# Altium project DIMM Module Tester CS.PrjPcb
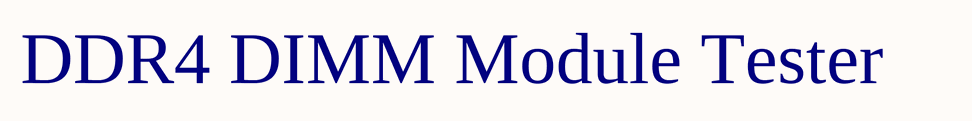
[diagram p0: DIMM Module Tester.SchDoc]
3 sheets, 287 parts. Net scope: global (net labels, ports and power ports of the same name join across sheets).
Sheets:
  DIMM Module Tester.SchDoc
  SPD.SchDoc
  Testpoints.SchDoc

## Sheet DIMM Module Tester.SchDoc
size A3

### Notes on the sheet
- DDR4 DIMM Module Tester

## Sheet SPD.SchDoc
size A3
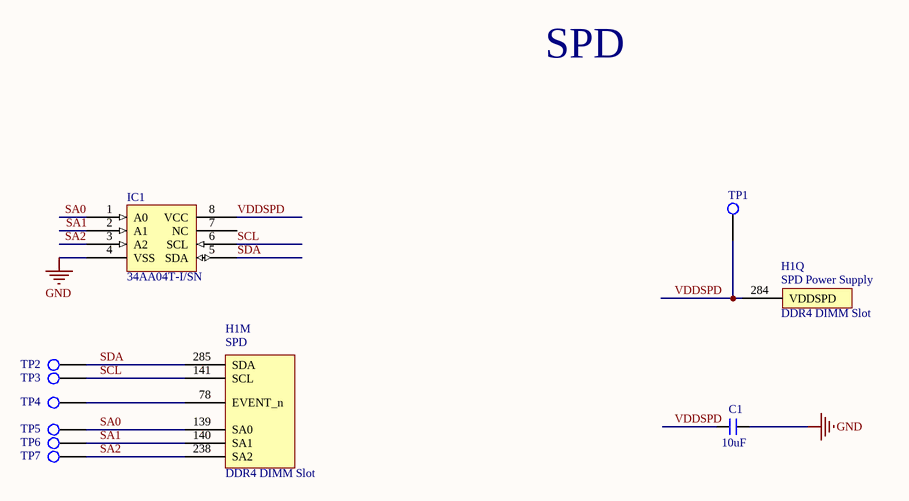
[diagram p1: SPD.SchDoc]

### Parts
C1  Capacitance: 10uF  [Capacitor 0603]  (hidden comment: Capacitor 0603)
H1  DDR4 DIMM Slot  [DDR4 DIMM]  (parts M,Q of 21)
IC1  34AA04T-I/SN  [34AA04T-I/SN]
TP1  Test Point  [Test Point]  (value not drawn)
TP2  Test Point  [Test Point]  (value not drawn)
TP3  Test Point  [Test Point]  (value not drawn)
TP4  Test Point  [Test Point]  (value not drawn)
TP5  Test Point  [Test Point]  (value not drawn)
TP6  Test Point  [Test Point]  (value not drawn)
TP7  Test Point  [Test Point]  (value not drawn)

### Nets
GND: C1.2 IC1.4(VSS)
SA0: H1.139(SA0) IC1.1(A0) TP5.1
SA1: H1.140(SA1) IC1.2(A1) TP6.1
SA2: H1.238(SA2) IC1.3(A2) TP7.1
SCL: H1.141(SCL) IC1.6(SCL) TP3.1
SDA: H1.285(SDA) IC1.5(SDA) TP2.1
VDDSPD: C1.1 H1.284(VDDSPD) IC1.8(VCC) TP1.1
NetH1_78: H1.78(EVENT_n) TP4.1

Not connected (* = marked no-connect by the designer): IC1 7(NC)

### Notes on the sheet
- SPD
- (in symbol DDR4 DIMM Slot, part M) SPD
- (in symbol DDR4 DIMM Slot, part Q) SPD Power Supply

### Library data of the parts
C1 = Capacitor 0603: Manufacturer: Vishay; Manufacturer Part Number: CRCW060310K0FKEA; Max Power Dissipation: 100mW; Tolerance: 1%; Voltage Rating: 75V; Temperature Coefficient: 100ppm/°C; Supplier 1: Avnet Europe; Stock 1: 305000; Pricing 1: 5000=0.00444, 10000=0.00432, 20000=0.00421, 30000=0.0041, 40000=0.004 (EUR); Case/Package: 0603; Number of Pins: 2; Weight: 7.1E-05oz; Contact Plating: Tin,Lead; Case Code (Metric): 1608; Case Code (Imperial): 0603; Min Operating Temperature: -55°C; Max Operating Temperature: 155°C; Packaging: Tape and Reel; Package Quantity: 10; Termination: SMD/SMT; Power Rating: 100mW; Composition: Thick Film; Number of Terminations: 2; Military Standard: Not; Voltage Rating (DC): 75V; Features: Automotive AEC-Q200; Length: 1.55mm; Height: 0.45mm; Width: 0.033inch; Depth: 0.85mm; Radiation Hardening: No; REACH SVHC: Unknown; Lead Free: Lead Free

## Sheet Testpoints.SchDoc
size A3
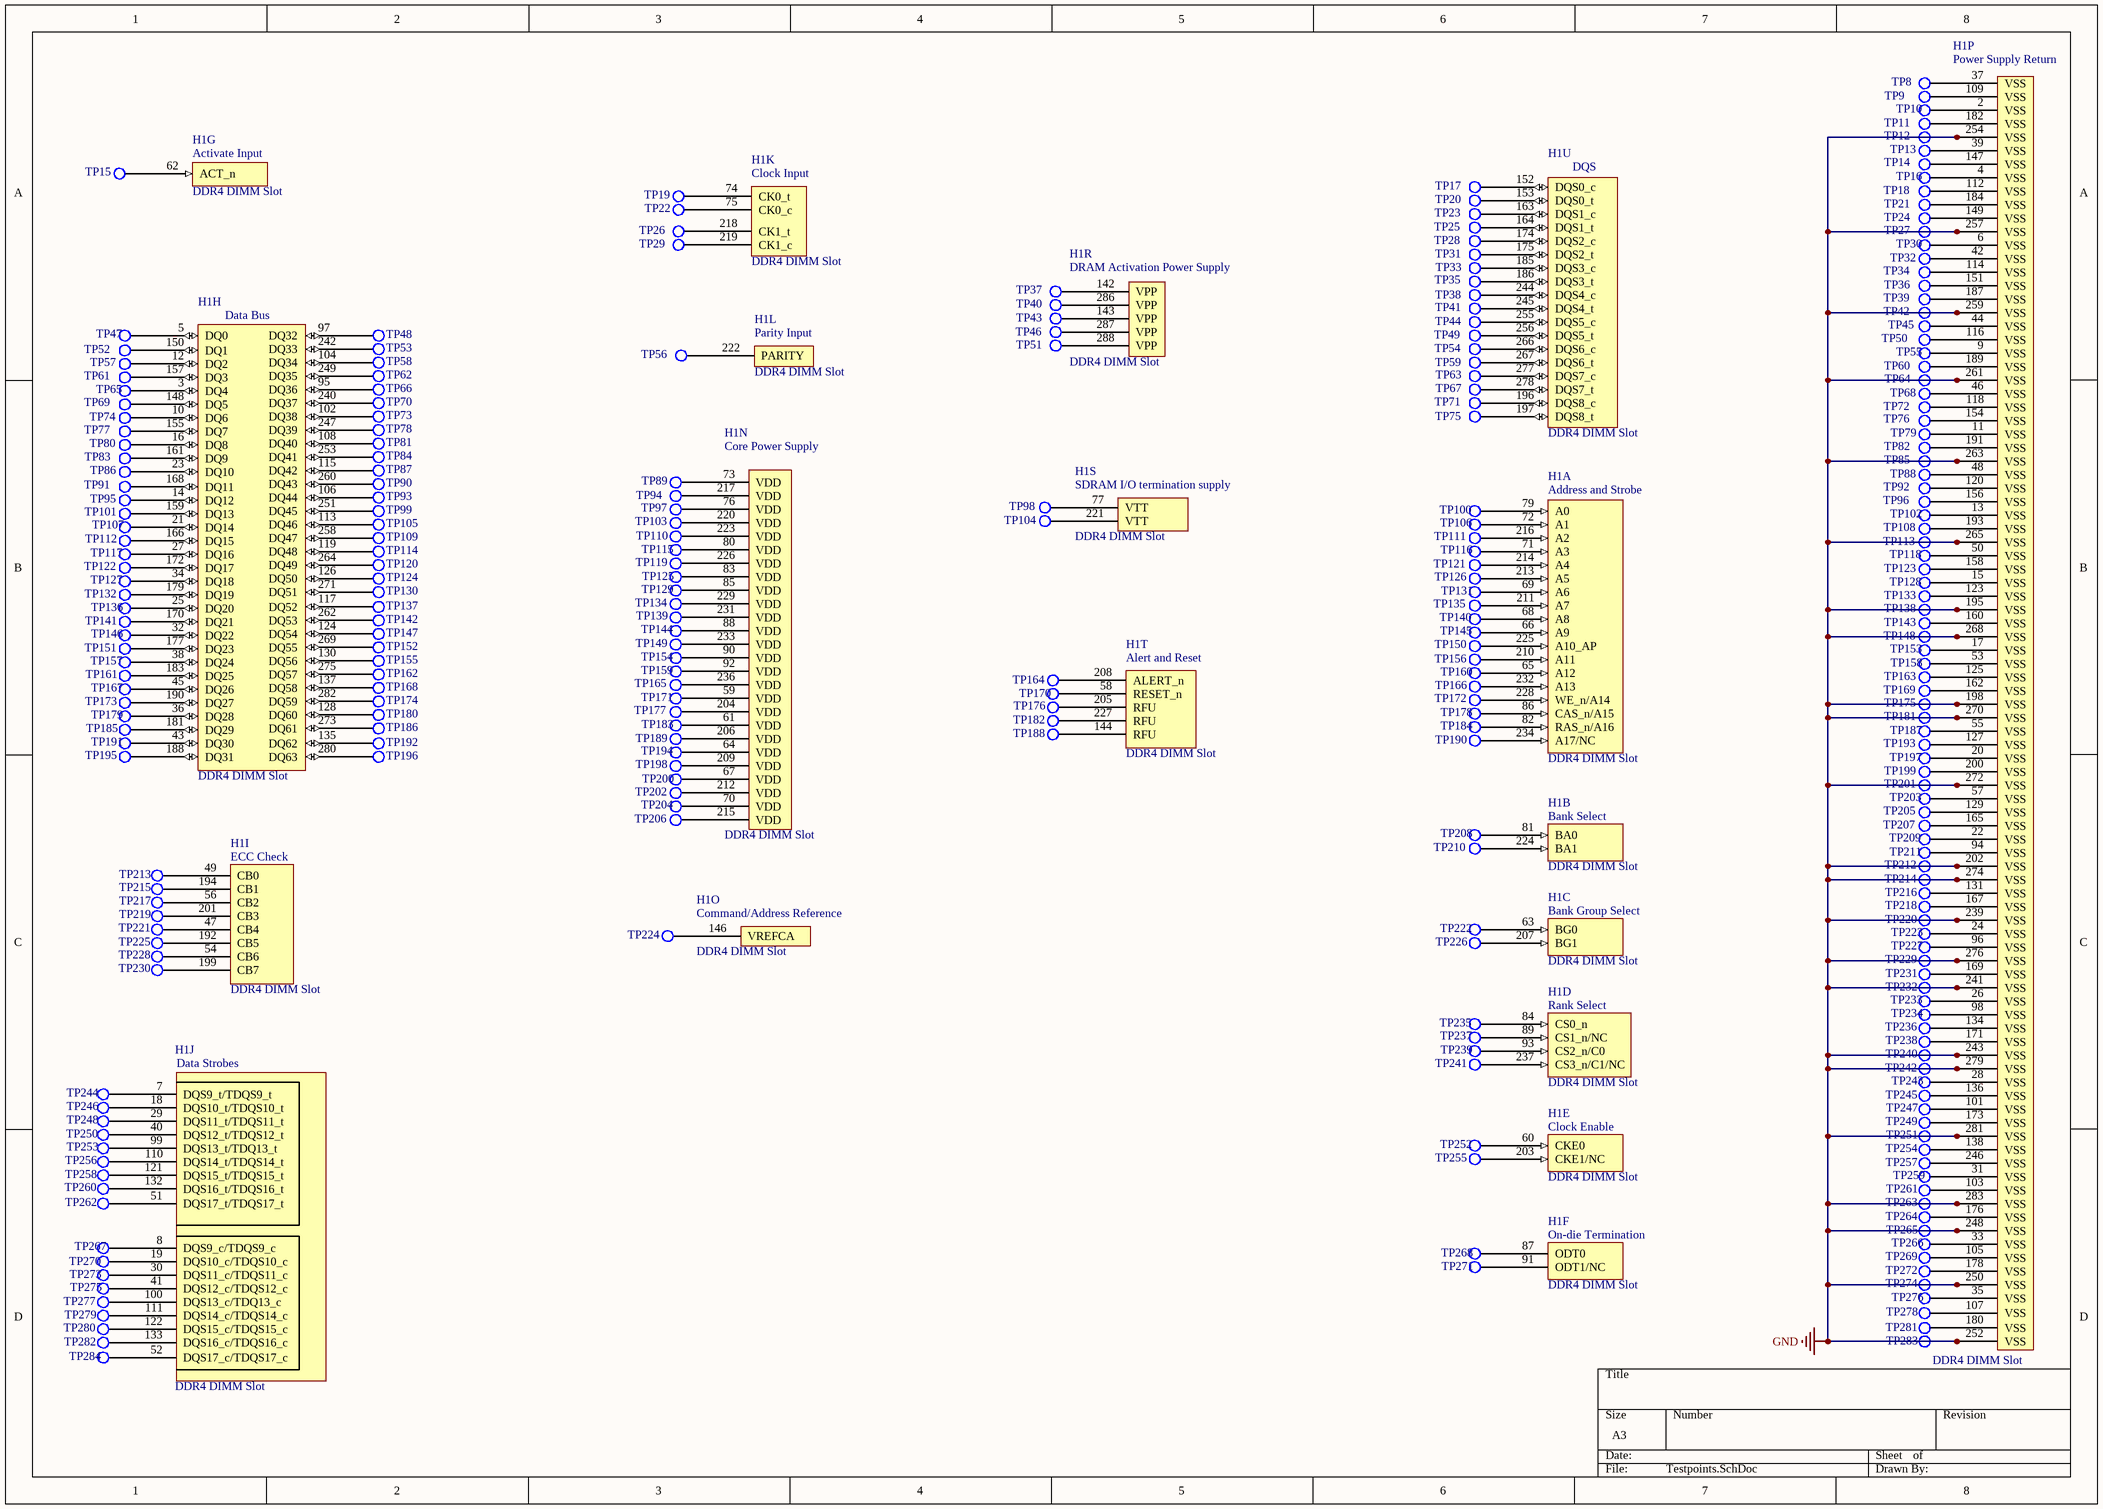
[diagram p2: Testpoints.SchDoc]

### Parts
H1  DDR4 DIMM Slot  [DDR4 DIMM]  (parts A,B,C,D,E,F,G,H,I,J,K,L,N,O,P,R,S,T,U of 21)
TP8  Test Point  [Test Point]  (value not drawn)
TP9  Test Point  [Test Point]  (value not drawn)
TP10  Test Point  [Test Point]  (value not drawn)
TP11  Test Point  [Test Point]  (value not drawn)
TP12  Test Point  [Test Point]  (value not drawn)
TP13  Test Point  [Test Point]  (value not drawn)
TP14  Test Point  [Test Point]  (value not drawn)
TP15  Test Point  [Test Point]  (value not drawn)
TP16  Test Point  [Test Point]  (value not drawn)
TP17  Test Point  [Test Point]  (value not drawn)
TP18  Test Point  [Test Point]  (value not drawn)
TP19  Test Point  [Test Point]  (value not drawn)
TP20  Test Point  [Test Point]  (value not drawn)
TP21  Test Point  [Test Point]  (value not drawn)
TP22  Test Point  [Test Point]  (value not drawn)
TP23  Test Point  [Test Point]  (value not drawn)
TP24  Test Point  [Test Point]  (value not drawn)
TP25  Test Point  [Test Point]  (value not drawn)
TP26  Test Point  [Test Point]  (value not drawn)
TP27  Test Point  [Test Point]  (value not drawn)
TP28  Test Point  [Test Point]  (value not drawn)
TP29  Test Point  [Test Point]  (value not drawn)
TP30  Test Point  [Test Point]  (value not drawn)
TP31  Test Point  [Test Point]  (value not drawn)
TP32  Test Point  [Test Point]  (value not drawn)
TP33  Test Point  [Test Point]  (value not drawn)
TP34  Test Point  [Test Point]  (value not drawn)
TP35  Test Point  [Test Point]  (value not drawn)
TP36  Test Point  [Test Point]  (value not drawn)
TP37  Test Point  [Test Point]  (value not drawn)
TP38  Test Point  [Test Point]  (value not drawn)
TP39  Test Point  [Test Point]  (value not drawn)
TP40  Test Point  [Test Point]  (value not drawn)
TP41  Test Point  [Test Point]  (value not drawn)
TP42  Test Point  [Test Point]  (value not drawn)
TP43  Test Point  [Test Point]  (value not drawn)
TP44  Test Point  [Test Point]  (value not drawn)
TP45  Test Point  [Test Point]  (value not drawn)
TP46  Test Point  [Test Point]  (value not drawn)
TP47  Test Point  [Test Point]  (value not drawn)
TP48  Test Point  [Test Point]  (value not drawn)
TP49  Test Point  [Test Point]  (value not drawn)
TP50  Test Point  [Test Point]  (value not drawn)
TP51  Test Point  [Test Point]  (value not drawn)
TP52  Test Point  [Test Point]  (value not drawn)
TP53  Test Point  [Test Point]  (value not drawn)
TP54  Test Point  [Test Point]  (value not drawn)
TP55  Test Point  [Test Point]  (value not drawn)
TP56  Test Point  [Test Point]  (value not drawn)
TP57  Test Point  [Test Point]  (value not drawn)
TP58  Test Point  [Test Point]  (value not drawn)
TP59  Test Point  [Test Point]  (value not drawn)
TP60  Test Point  [Test Point]  (value not drawn)
TP61  Test Point  [Test Point]  (value not drawn)
TP62  Test Point  [Test Point]  (value not drawn)
TP63  Test Point  [Test Point]  (value not drawn)
TP64  Test Point  [Test Point]  (value not drawn)
TP65  Test Point  [Test Point]  (value not drawn)
TP66  Test Point  [Test Point]  (value not drawn)
TP67  Test Point  [Test Point]  (value not drawn)
TP68  Test Point  [Test Point]  (value not drawn)
TP69  Test Point  [Test Point]  (value not drawn)
TP70  Test Point  [Test Point]  (value not drawn)
TP71  Test Point  [Test Point]  (value not drawn)
TP72  Test Point  [Test Point]  (value not drawn)
TP73  Test Point  [Test Point]  (value not drawn)
TP74  Test Point  [Test Point]  (value not drawn)
TP75  Test Point  [Test Point]  (value not drawn)
TP76  Test Point  [Test Point]  (value not drawn)
TP77  Test Point  [Test Point]  (value not drawn)
TP78  Test Point  [Test Point]  (value not drawn)
TP79  Test Point  [Test Point]  (value not drawn)
TP80  Test Point  [Test Point]  (value not drawn)
TP81  Test Point  [Test Point]  (value not drawn)
TP82  Test Point  [Test Point]  (value not drawn)
TP83  Test Point  [Test Point]  (value not drawn)
TP84  Test Point  [Test Point]  (value not drawn)
TP85  Test Point  [Test Point]  (value not drawn)
TP86  Test Point  [Test Point]  (value not drawn)
TP87  Test Point  [Test Point]  (value not drawn)
TP88  Test Point  [Test Point]  (value not drawn)
TP89  Test Point  [Test Point]  (value not drawn)
TP90  Test Point  [Test Point]  (value not drawn)
TP91  Test Point  [Test Point]  (value not drawn)
TP92  Test Point  [Test Point]  (value not drawn)
TP93  Test Point  [Test Point]  (value not drawn)
TP94  Test Point  [Test Point]  (value not drawn)
TP95  Test Point  [Test Point]  (value not drawn)
TP96  Test Point  [Test Point]  (value not drawn)
TP97  Test Point  [Test Point]  (value not drawn)
TP98  Test Point  [Test Point]  (value not drawn)
TP99  Test Point  [Test Point]  (value not drawn)
TP100  Test Point  [Test Point]  (value not drawn)
TP101  Test Point  [Test Point]  (value not drawn)
TP102  Test Point  [Test Point]  (value not drawn)
TP103  Test Point  [Test Point]  (value not drawn)
TP104  Test Point  [Test Point]  (value not drawn)
TP105  Test Point  [Test Point]  (value not drawn)
TP106  Test Point  [Test Point]  (value not drawn)
TP107  Test Point  [Test Point]  (value not drawn)
TP108  Test Point  [Test Point]  (value not drawn)
TP109  Test Point  [Test Point]  (value not drawn)
TP110  Test Point  [Test Point]  (value not drawn)
TP111  Test Point  [Test Point]  (value not drawn)
TP112  Test Point  [Test Point]  (value not drawn)
TP113  Test Point  [Test Point]  (value not drawn)
TP114  Test Point  [Test Point]  (value not drawn)
TP115  Test Point  [Test Point]  (value not drawn)
TP116  Test Point  [Test Point]  (value not drawn)
TP117  Test Point  [Test Point]  (value not drawn)
TP118  Test Point  [Test Point]  (value not drawn)
TP119  Test Point  [Test Point]  (value not drawn)
TP120  Test Point  [Test Point]  (value not drawn)
TP121  Test Point  [Test Point]  (value not drawn)
TP122  Test Point  [Test Point]  (value not drawn)
TP123  Test Point  [Test Point]  (value not drawn)
TP124  Test Point  [Test Point]  (value not drawn)
TP125  Test Point  [Test Point]  (value not drawn)
TP126  Test Point  [Test Point]  (value not drawn)
TP127  Test Point  [Test Point]  (value not drawn)
TP128  Test Point  [Test Point]  (value not drawn)
TP129  Test Point  [Test Point]  (value not drawn)
TP130  Test Point  [Test Point]  (value not drawn)
TP131  Test Point  [Test Point]  (value not drawn)
TP132  Test Point  [Test Point]  (value not drawn)
TP133  Test Point  [Test Point]  (value not drawn)
TP134  Test Point  [Test Point]  (value not drawn)
TP135  Test Point  [Test Point]  (value not drawn)
TP136  Test Point  [Test Point]  (value not drawn)
TP137  Test Point  [Test Point]  (value not drawn)
TP138  Test Point  [Test Point]  (value not drawn)
TP139  Test Point  [Test Point]  (value not drawn)
TP140  Test Point  [Test Point]  (value not drawn)
TP141  Test Point  [Test Point]  (value not drawn)
TP142  Test Point  [Test Point]  (value not drawn)
TP143  Test Point  [Test Point]  (value not drawn)
TP144  Test Point  [Test Point]  (value not drawn)
TP145  Test Point  [Test Point]  (value not drawn)
TP146  Test Point  [Test Point]  (value not drawn)
TP147  Test Point  [Test Point]  (value not drawn)
TP148  Test Point  [Test Point]  (value not drawn)
TP149  Test Point  [Test Point]  (value not drawn)
TP150  Test Point  [Test Point]  (value not drawn)
TP151  Test Point  [Test Point]  (value not drawn)
TP152  Test Point  [Test Point]  (value not drawn)
TP153  Test Point  [Test Point]  (value not drawn)
TP154  Test Point  [Test Point]  (value not drawn)
TP155  Test Point  [Test Point]  (value not drawn)
TP156  Test Point  [Test Point]  (value not drawn)
TP157  Test Point  [Test Point]  (value not drawn)
TP158  Test Point  [Test Point]  (value not drawn)
TP159  Test Point  [Test Point]  (value not drawn)
TP160  Test Point  [Test Point]  (value not drawn)
TP161  Test Point  [Test Point]  (value not drawn)
TP162  Test Point  [Test Point]  (value not drawn)
TP163  Test Point  [Test Point]  (value not drawn)
TP164  Test Point  [Test Point]  (value not drawn)
TP165  Test Point  [Test Point]  (value not drawn)
TP166  Test Point  [Test Point]  (value not drawn)
TP167  Test Point  [Test Point]  (value not drawn)
TP168  Test Point  [Test Point]  (value not drawn)
TP169  Test Point  [Test Point]  (value not drawn)
TP170  Test Point  [Test Point]  (value not drawn)
TP171  Test Point  [Test Point]  (value not drawn)
TP172  Test Point  [Test Point]  (value not drawn)
TP173  Test Point  [Test Point]  (value not drawn)
TP174  Test Point  [Test Point]  (value not drawn)
TP175  Test Point  [Test Point]  (value not drawn)
TP176  Test Point  [Test Point]  (value not drawn)
TP177  Test Point  [Test Point]  (value not drawn)
TP178  Test Point  [Test Point]  (value not drawn)
TP179  Test Point  [Test Point]  (value not drawn)
TP180  Test Point  [Test Point]  (value not drawn)
TP181  Test Point  [Test Point]  (value not drawn)
TP182  Test Point  [Test Point]  (value not drawn)
TP183  Test Point  [Test Point]  (value not drawn)
TP184  Test Point  [Test Point]  (value not drawn)
TP185  Test Point  [Test Point]  (value not drawn)
TP186  Test Point  [Test Point]  (value not drawn)
TP187  Test Point  [Test Point]  (value not drawn)
TP188  Test Point  [Test Point]  (value not drawn)
TP189  Test Point  [Test Point]  (value not drawn)
TP190  Test Point  [Test Point]  (value not drawn)
TP191  Test Point  [Test Point]  (value not drawn)
TP192  Test Point  [Test Point]  (value not drawn)
TP193  Test Point  [Test Point]  (value not drawn)
TP194  Test Point  [Test Point]  (value not drawn)
TP195  Test Point  [Test Point]  (value not drawn)
TP196  Test Point  [Test Point]  (value not drawn)
TP197  Test Point  [Test Point]  (value not drawn)
TP198  Test Point  [Test Point]  (value not drawn)
TP199  Test Point  [Test Point]  (value not drawn)
TP200  Test Point  [Test Point]  (value not drawn)
TP201  Test Point  [Test Point]  (value not drawn)
TP202  Test Point  [Test Point]  (value not drawn)
TP203  Test Point  [Test Point]  (value not drawn)
TP204  Test Point  [Test Point]  (value not drawn)
TP205  Test Point  [Test Point]  (value not drawn)
TP206  Test Point  [Test Point]  (value not drawn)
TP207  Test Point  [Test Point]  (value not drawn)
TP208  Test Point  [Test Point]  (value not drawn)
TP209  Test Point  [Test Point]  (value not drawn)
TP210  Test Point  [Test Point]  (value not drawn)
TP211  Test Point  [Test Point]  (value not drawn)
TP212  Test Point  [Test Point]  (value not drawn)
TP213  Test Point  [Test Point]  (value not drawn)
TP214  Test Point  [Test Point]  (value not drawn)
TP215  Test Point  [Test Point]  (value not drawn)
TP216  Test Point  [Test Point]  (value not drawn)
TP217  Test Point  [Test Point]  (value not drawn)
TP218  Test Point  [Test Point]  (value not drawn)
TP219  Test Point  [Test Point]  (value not drawn)
TP220  Test Point  [Test Point]  (value not drawn)
TP221  Test Point  [Test Point]  (value not drawn)
TP222  Test Point  [Test Point]  (value not drawn)
TP223  Test Point  [Test Point]  (value not drawn)
TP224  Test Point  [Test Point]  (value not drawn)
TP225  Test Point  [Test Point]  (value not drawn)
TP226  Test Point  [Test Point]  (value not drawn)
TP227  Test Point  [Test Point]  (value not drawn)
TP228  Test Point  [Test Point]  (value not drawn)
TP229  Test Point  [Test Point]  (value not drawn)
TP230  Test Point  [Test Point]  (value not drawn)
TP231  Test Point  [Test Point]  (value not drawn)
TP232  Test Point  [Test Point]  (value not drawn)
TP233  Test Point  [Test Point]  (value not drawn)
TP234  Test Point  [Test Point]  (value not drawn)
TP235  Test Point  [Test Point]  (value not drawn)
TP236  Test Point  [Test Point]  (value not drawn)
TP237  Test Point  [Test Point]  (value not drawn)
TP238  Test Point  [Test Point]  (value not drawn)
TP239  Test Point  [Test Point]  (value not drawn)
TP240  Test Point  [Test Point]  (value not drawn)
TP241  Test Point  [Test Point]  (value not drawn)
TP242  Test Point  [Test Point]  (value not drawn)
TP243  Test Point  [Test Point]  (value not drawn)
TP244  Test Point  [Test Point]  (value not drawn)
TP245  Test Point  [Test Point]  (value not drawn)
TP246  Test Point  [Test Point]  (value not drawn)
TP247  Test Point  [Test Point]  (value not drawn)
TP248  Test Point  [Test Point]  (value not drawn)
TP249  Test Point  [Test Point]  (value not drawn)
TP250  Test Point  [Test Point]  (value not drawn)
TP251  Test Point  [Test Point]  (value not drawn)
TP252  Test Point  [Test Point]  (value not drawn)
TP253  Test Point  [Test Point]  (value not drawn)
TP254  Test Point  [Test Point]  (value not drawn)
TP255  Test Point  [Test Point]  (value not drawn)
TP256  Test Point  [Test Point]  (value not drawn)
TP257  Test Point  [Test Point]  (value not drawn)
TP258  Test Point  [Test Point]  (value not drawn)
TP259  Test Point  [Test Point]  (value not drawn)
TP260  Test Point  [Test Point]  (value not drawn)
TP261  Test Point  [Test Point]  (value not drawn)
TP262  Test Point  [Test Point]  (value not drawn)
TP263  Test Point  [Test Point]  (value not drawn)
TP264  Test Point  [Test Point]  (value not drawn)
TP265  Test Point  [Test Point]  (value not drawn)
TP266  Test Point  [Test Point]  (value not drawn)
TP267  Test Point  [Test Point]  (value not drawn)
TP268  Test Point  [Test Point]  (value not drawn)
TP269  Test Point  [Test Point]  (value not drawn)
TP270  Test Point  [Test Point]  (value not drawn)
TP271  Test Point  [Test Point]  (value not drawn)
TP272  Test Point  [Test Point]  (value not drawn)
TP273  Test Point  [Test Point]  (value not drawn)
TP274  Test Point  [Test Point]  (value not drawn)
TP275  Test Point  [Test Point]  (value not drawn)
TP276  Test Point  [Test Point]  (value not drawn)
TP277  Test Point  [Test Point]  (value not drawn)
TP278  Test Point  [Test Point]  (value not drawn)
TP279  Test Point  [Test Point]  (value not drawn)
TP280  Test Point  [Test Point]  (value not drawn)
TP281  Test Point  [Test Point]  (value not drawn)
TP282  Test Point  [Test Point]  (value not drawn)
TP283  Test Point  [Test Point]  (value not drawn)
TP284  Test Point  [Test Point]  (value not drawn)

### Nets
GND: H1.195(VSS) H1.198(VSS) H1.202(VSS) H1.239(VSS) H1.241(VSS) H1.243(VSS) H1.248(VSS) H1.250(VSS) H1.252(VSS) H1.254(VSS) H1.257(VSS) H1.259(VSS) H1.261(VSS) H1.263(VSS) H1.265(VSS) H1.268(VSS) H1.270(VSS) H1.272(VSS) H1.274(VSS) H1.276(VSS) H1.279(VSS) H1.281(VSS) H1.283(VSS) TP12.1 TP27.1 TP42.1 TP64.1 TP85.1 TP113.1 TP138.1 TP148.1 TP175.1 TP181.1 TP201.1 TP212.1 TP214.1 TP220.1 TP229.1 TP232.1 TP240.1 TP242.1 TP251.1 TP263.1 TP265.1 TP274.1 TP283.1
NetH1_2: H1.2(VSS) TP10.1
NetH1_3: H1.3(DQ4) TP65.1
NetH1_4: H1.4(VSS) TP16.1
NetH1_5: H1.5(DQ0) TP47.1
NetH1_6: H1.6(VSS) TP30.1
NetH1_7: H1.7(DQS9_t/TDQS9_t) TP244.1
NetH1_8: H1.8(DQS9_c/TDQS9_c) TP267.1
NetH1_9: H1.9(VSS) TP55.1
NetH1_10: H1.10(DQ6) TP74.1
NetH1_11: H1.11(VSS) TP79.1
NetH1_12: H1.12(DQ2) TP57.1
NetH1_13: H1.13(VSS) TP102.1
NetH1_14: H1.14(DQ12) TP95.1
NetH1_15: H1.15(VSS) TP128.1
NetH1_16: H1.16(DQ8) TP80.1
NetH1_17: H1.17(VSS) TP153.1
NetH1_18: H1.18(DQS10_t/TDQS10_t) TP246.1
NetH1_19: H1.19(DQS10_c/TDQS10_c) TP270.1
NetH1_20: H1.20(VSS) TP197.1
NetH1_21: H1.21(DQ14) TP107.1
NetH1_22: H1.22(VSS) TP209.1
NetH1_23: H1.23(DQ10) TP86.1
NetH1_24: H1.24(VSS) TP223.1
NetH1_25: H1.25(DQ20) TP136.1
NetH1_26: H1.26(VSS) TP233.1
NetH1_27: H1.27(DQ16) TP117.1
NetH1_28: H1.28(VSS) TP243.1
NetH1_29: H1.29(DQS11_t/TDQS11_t) TP248.1
NetH1_30: H1.30(DQS11_c/TDQS11_c) TP273.1
NetH1_31: H1.31(VSS) TP259.1
NetH1_32: H1.32(DQ22) TP146.1
NetH1_33: H1.33(VSS) TP266.1
NetH1_34: H1.34(DQ18) TP127.1
NetH1_35: H1.35(VSS) TP276.1
NetH1_36: H1.36(DQ28) TP179.1
NetH1_37: H1.37(VSS) TP8.1
NetH1_38: H1.38(DQ24) TP157.1
NetH1_39: H1.39(VSS) TP13.1
NetH1_40: H1.40(DQS12_t/TDQS12_t) TP250.1
NetH1_41: H1.41(DQS12_c/TDQS12_c) TP275.1
NetH1_42: H1.42(VSS) TP32.1
NetH1_43: H1.43(DQ30) TP191.1
NetH1_44: H1.44(VSS) TP45.1
NetH1_45: H1.45(DQ26) TP167.1
NetH1_46: H1.46(VSS) TP68.1
NetH1_47: H1.47(CB4) TP221.1
NetH1_48: H1.48(VSS) TP88.1
NetH1_49: H1.49(CB0) TP213.1
NetH1_50: H1.50(VSS) TP118.1
NetH1_51: H1.51(DQS17_t/TDQS17_t) TP262.1
NetH1_52: H1.52(DQS17_c/TDQS17_c) TP284.1
NetH1_53: H1.53(VSS) TP158.1
NetH1_54: H1.54(CB6) TP228.1
NetH1_55: H1.55(VSS) TP187.1
NetH1_56: H1.56(CB2) TP217.1
NetH1_57: H1.57(VSS) TP203.1
NetH1_58: H1.58(RESET_n) TP170.1
NetH1_59: H1.59(VDD) TP171.1
NetH1_60: H1.60(CKE0) TP252.1
NetH1_61: H1.61(VDD) TP183.1
NetH1_62: H1.62(ACT_n) TP15.1
NetH1_63: H1.63(BG0) TP222.1
NetH1_64: H1.64(VDD) TP194.1
NetH1_65: H1.65(A12) TP160.1
NetH1_66: H1.66(A9) TP145.1
NetH1_67: H1.67(VDD) TP200.1
NetH1_68: H1.68(A8) TP140.1
NetH1_69: H1.69(A6) TP131.1
NetH1_70: H1.70(VDD) TP204.1
NetH1_71: H1.71(A3) TP116.1
NetH1_72: H1.72(A1) TP106.1
NetH1_73: H1.73(VDD) TP89.1
NetH1_74: H1.74(CK0_t) TP19.1
NetH1_75: H1.75(CK0_c) TP22.1
NetH1_76: H1.76(VDD) TP97.1
NetH1_77: H1.77(VTT) TP98.1
NetH1_79: H1.79(A0) TP100.1
NetH1_80: H1.80(VDD) TP115.1
NetH1_81: H1.81(BA0) TP208.1
NetH1_82: H1.82(RAS_n/A16) TP184.1
NetH1_83: H1.83(VDD) TP125.1
NetH1_84: H1.84(CS0_n) TP235.1
NetH1_85: H1.85(VDD) TP129.1
NetH1_86: H1.86(CAS_n/A15) TP178.1
NetH1_87: H1.87(ODT0) TP268.1
NetH1_88: H1.88(VDD) TP144.1
NetH1_89: H1.89(CS1_n/NC) TP237.1
NetH1_90: H1.90(VDD) TP154.1
NetH1_91: H1.91(ODT1/NC) TP271.1
NetH1_92: H1.92(VDD) TP159.1
NetH1_93: H1.93(CS2_n/C0) TP239.1
NetH1_94: H1.94(VSS) TP211.1
NetH1_95: H1.95(DQ36) TP66.1
NetH1_96: H1.96(VSS) TP227.1
NetH1_97: H1.97(DQ32) TP48.1
NetH1_98: H1.98(VSS) TP234.1
NetH1_99: H1.99(DQS13_t/TDQ13_t) TP253.1
NetH1_100: H1.100(DQS13_c/TDQ13_c) TP277.1
NetH1_101: H1.101(VSS) TP247.1
NetH1_102: H1.102(DQ38) TP73.1
NetH1_103: H1.103(VSS) TP261.1
NetH1_104: H1.104(DQ34) TP58.1
NetH1_105: H1.105(VSS) TP269.1
NetH1_106: H1.106(DQ44) TP93.1
NetH1_107: H1.107(VSS) TP278.1
NetH1_108: H1.108(DQ40) TP81.1
NetH1_109: H1.109(VSS) TP9.1
NetH1_110: H1.110(DQS14_t/TDQS14_t) TP256.1
NetH1_111: H1.111(DQS14_c/TDQS14_c) TP279.1
NetH1_112: H1.112(VSS) TP18.1
NetH1_113: H1.113(DQ46) TP105.1
NetH1_114: H1.114(VSS) TP34.1
NetH1_115: H1.115(DQ42) TP87.1
NetH1_116: H1.116(VSS) TP50.1
NetH1_117: H1.117(DQ52) TP137.1
NetH1_118: H1.118(VSS) TP72.1
NetH1_119: H1.119(DQ48) TP114.1
NetH1_120: H1.120(VSS) TP92.1
NetH1_121: H1.121(DQS15_t/TDQS15_t) TP258.1
NetH1_122: H1.122(DQS15_c/TDQS15_c) TP280.1
NetH1_123: H1.123(VSS) TP133.1
NetH1_124: H1.124(DQ54) TP147.1
NetH1_125: H1.125(VSS) TP163.1
NetH1_126: H1.126(DQ50) TP124.1
NetH1_127: H1.127(VSS) TP193.1
NetH1_128: H1.128(DQ60) TP180.1
NetH1_129: H1.129(VSS) TP205.1
NetH1_130: H1.130(DQ56) TP155.1
NetH1_131: H1.131(VSS) TP216.1
NetH1_132: H1.132(DQS16_t/TDQS16_t) TP260.1
NetH1_133: H1.133(DQS16_c/TDQS16_c) TP282.1
NetH1_134: H1.134(VSS) TP236.1
NetH1_135: H1.135(DQ62) TP192.1
NetH1_136: H1.136(VSS) TP245.1
NetH1_137: H1.137(DQ58) TP168.1
NetH1_138: H1.138(VSS) TP254.1
NetH1_142: H1.142(VPP) TP37.1
NetH1_143: H1.143(VPP) TP43.1
NetH1_144: H1.144(RFU) TP188.1
NetH1_146: H1.146(VREFCA) TP224.1
NetH1_147: H1.147(VSS) TP14.1
NetH1_148: H1.148(DQ5) TP69.1
NetH1_149: H1.149(VSS) TP24.1
NetH1_150: H1.150(DQ1) TP52.1
NetH1_151: H1.151(VSS) TP36.1
NetH1_152: H1.152(DQS0_c) TP17.1
NetH1_153: H1.153(DQS0_t) TP20.1
NetH1_154: H1.154(VSS) TP76.1
NetH1_155: H1.155(DQ7) TP77.1
NetH1_156: H1.156(VSS) TP96.1
NetH1_157: H1.157(DQ3) TP61.1
NetH1_158: H1.158(VSS) TP123.1
NetH1_159: H1.159(DQ13) TP101.1
NetH1_160: H1.160(VSS) TP143.1
NetH1_161: H1.161(DQ9) TP83.1
NetH1_162: H1.162(VSS) TP169.1
NetH1_163: H1.163(DQS1_c) TP23.1
NetH1_164: H1.164(DQS1_t) TP25.1
NetH1_165: H1.165(VSS) TP207.1
NetH1_166: H1.166(DQ15) TP112.1
NetH1_167: H1.167(VSS) TP218.1
NetH1_168: H1.168(DQ11) TP91.1
NetH1_169: H1.169(VSS) TP231.1
NetH1_170: H1.170(DQ21) TP141.1
NetH1_171: H1.171(VSS) TP238.1
NetH1_172: H1.172(DQ17) TP122.1
NetH1_173: H1.173(VSS) TP249.1
NetH1_174: H1.174(DQS2_c) TP28.1
NetH1_175: H1.175(DQS2_t) TP31.1
NetH1_176: H1.176(VSS) TP264.1
NetH1_177: H1.177(DQ23) TP151.1
NetH1_178: H1.178(VSS) TP272.1
NetH1_179: H1.179(DQ19) TP132.1
NetH1_180: H1.180(VSS) TP281.1
NetH1_181: H1.181(DQ29) TP185.1
NetH1_182: H1.182(VSS) TP11.1
NetH1_183: H1.183(DQ25) TP161.1
NetH1_184: H1.184(VSS) TP21.1
NetH1_185: H1.185(DQS3_c) TP33.1
NetH1_186: H1.186(DQS3_t) TP35.1
NetH1_187: H1.187(VSS) TP39.1
NetH1_188: H1.188(DQ31) TP195.1
NetH1_189: H1.189(VSS) TP60.1
NetH1_190: H1.190(DQ27) TP173.1
NetH1_191: H1.191(VSS) TP82.1
NetH1_192: H1.192(CB5) TP225.1
NetH1_193: H1.193(VSS) TP108.1
NetH1_194: H1.194(CB1) TP215.1
NetH1_196: H1.196(DQS8_c) TP71.1
NetH1_197: H1.197(DQS8_t) TP75.1
NetH1_199: H1.199(CB7) TP230.1
NetH1_200: H1.200(VSS) TP199.1
NetH1_201: H1.201(CB3) TP219.1
NetH1_203: H1.203(CKE1/NC) TP255.1
NetH1_204: H1.204(VDD) TP177.1
NetH1_205: H1.205(RFU) TP176.1
NetH1_206: H1.206(VDD) TP189.1
NetH1_207: H1.207(BG1) TP226.1
NetH1_208: H1.208(ALERT_n) TP164.1
NetH1_209: H1.209(VDD) TP198.1
NetH1_210: H1.210(A11) TP156.1
NetH1_211: H1.211(A7) TP135.1
NetH1_212: H1.212(VDD) TP202.1
NetH1_213: H1.213(A5) TP126.1
NetH1_214: H1.214(A4) TP121.1
NetH1_215: H1.215(VDD) TP206.1
NetH1_216: H1.216(A2) TP111.1
NetH1_217: H1.217(VDD) TP94.1
NetH1_218: H1.218(CK1_t) TP26.1
NetH1_219: H1.219(CK1_c) TP29.1
NetH1_220: H1.220(VDD) TP103.1
NetH1_221: H1.221(VTT) TP104.1
NetH1_222: H1.222(PARITY) TP56.1
NetH1_223: H1.223(VDD) TP110.1
NetH1_224: H1.224(BA1) TP210.1
NetH1_225: H1.225(A10_AP) TP150.1
NetH1_226: H1.226(VDD) TP119.1
NetH1_227: H1.227(RFU) TP182.1
NetH1_228: H1.228(WE_n/A14) TP172.1
NetH1_229: H1.229(VDD) TP134.1
NetH1_231: H1.231(VDD) TP139.1
NetH1_232: H1.232(A13) TP166.1
NetH1_233: H1.233(VDD) TP149.1
NetH1_234: H1.234(A17/NC) TP190.1
NetH1_236: H1.236(VDD) TP165.1
NetH1_237: H1.237(CS3_n/C1/NC) TP241.1
NetH1_240: H1.240(DQ37) TP70.1
NetH1_242: H1.242(DQ33) TP53.1
NetH1_244: H1.244(DQS4_c) TP38.1
NetH1_245: H1.245(DQS4_t) TP41.1
NetH1_246: H1.246(VSS) TP257.1
NetH1_247: H1.247(DQ39) TP78.1
NetH1_249: H1.249(DQ35) TP62.1
NetH1_251: H1.251(DQ45) TP99.1
NetH1_253: H1.253(DQ41) TP84.1
NetH1_255: H1.255(DQS5_c) TP44.1
NetH1_256: H1.256(DQS5_t) TP49.1
NetH1_258: H1.258(DQ47) TP109.1
NetH1_260: H1.260(DQ43) TP90.1
NetH1_262: H1.262(DQ53) TP142.1
NetH1_264: H1.264(DQ49) TP120.1
NetH1_266: H1.266(DQS6_c) TP54.1
NetH1_267: H1.267(DQS6_t) TP59.1
NetH1_269: H1.269(DQ55) TP152.1
NetH1_271: H1.271(DQ51) TP130.1
NetH1_273: H1.273(DQ61) TP186.1
NetH1_275: H1.275(DQ57) TP162.1
NetH1_277: H1.277(DQS7_c) TP63.1
NetH1_278: H1.278(DQS7_t) TP67.1
NetH1_280: H1.280(DQ63) TP196.1
NetH1_282: H1.282(DQ59) TP174.1
NetH1_286: H1.286(VPP) TP40.1
NetH1_287: H1.287(VPP) TP46.1
NetH1_288: H1.288(VPP) TP51.1

### Notes on the sheet
- (in symbol DDR4 DIMM Slot, part A) Address and Strobe
- (in symbol DDR4 DIMM Slot, part B) Bank Select
- (in symbol DDR4 DIMM Slot, part C) Bank Group Select
- (in symbol DDR4 DIMM Slot, part D) Rank Select
- (in symbol DDR4 DIMM Slot, part E) Clock Enable
- (in symbol DDR4 DIMM Slot, part F) On-die Termination
- (in symbol DDR4 DIMM Slot, part G) Activate Input
- (in symbol DDR4 DIMM Slot, part H) Data Bus
- (in symbol DDR4 DIMM Slot, part I) ECC Check
- (in symbol DDR4 DIMM Slot, part J) Data Strobes
- (in symbol DDR4 DIMM Slot, part K) Clock Input
- (in symbol DDR4 DIMM Slot, part L) Parity Input
- (in symbol DDR4 DIMM Slot, part N) Core Power Supply
- (in symbol DDR4 DIMM Slot, part O) Command/Address Reference
- (in symbol DDR4 DIMM Slot, part P) Power Supply Return
- (in symbol DDR4 DIMM Slot, part R) DRAM Activation Power Supply
- (in symbol DDR4 DIMM Slot, part S) SDRAM I/O termination supply
- (in symbol DDR4 DIMM Slot, part T) Alert and Reset
- (in symbol DDR4 DIMM Slot, part U) DQS

## Nets that join several sheets
GND: SPD (C1.2 IC1.4), Testpoints (46 pins)